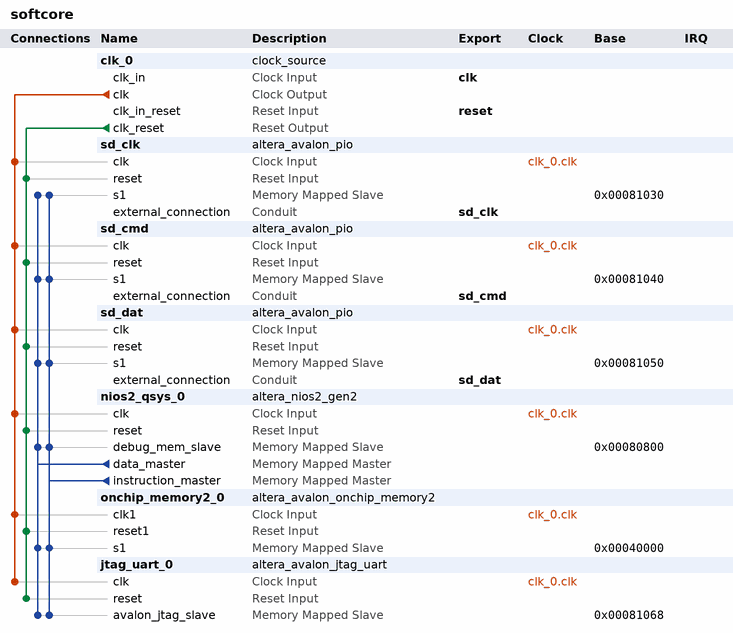
[diagram p0: system contents]
# Platform Designer (Qsys) system softcore, Cyclone V 5CEBA4F23C7
# Parameters at their usual value, and those the tool derives, are not listed.
package require -exact qsys 17.0
create_system softcore
set_project_property DEVICE_FAMILY {Cyclone V}
set_project_property DEVICE 5CEBA4F23C7

add_instance clk_0 clock_source 17.0
set_instance_parameter_value clk_0 clockFrequency 50000000

add_instance sd_clk altera_avalon_pio 17.0
set_instance_parameter_value sd_clk direction Output
set_instance_parameter_value sd_clk width 1

add_instance sd_cmd altera_avalon_pio 17.0
set_instance_parameter_value sd_cmd direction Bidir
set_instance_parameter_value sd_cmd width 1

add_instance sd_dat altera_avalon_pio 17.0
set_instance_parameter_value sd_dat direction Bidir
set_instance_parameter_value sd_dat width 4

add_instance nios2_qsys_0 altera_nios2_gen2 17.0
set_instance_parameter_value nios2_qsys_0 dcache_size 2048
set_instance_parameter_value nios2_qsys_0 exceptionSlave onchip_memory2_0.s1
set_instance_parameter_value nios2_qsys_0 icache_size 4096
set_instance_parameter_value nios2_qsys_0 impl Tiny
set_instance_parameter_value nios2_qsys_0 resetSlave onchip_memory2_0.s1
set_instance_parameter_value nios2_qsys_0 setting_activateTrace true

add_instance onchip_memory2_0 altera_avalon_onchip_memory2 17.0
set_instance_parameter_value onchip_memory2_0 dataWidth 32
set_instance_parameter_value onchip_memory2_0 dualPort false
set_instance_parameter_value onchip_memory2_0 initMemContent true
set_instance_parameter_value onchip_memory2_0 initializationFileName onchip_mem.hex
set_instance_parameter_value onchip_memory2_0 memorySize 262144

add_instance jtag_uart_0 altera_avalon_jtag_uart 17.0
set_instance_parameter_value jtag_uart_0 simInteractiveOptions NO_INTERACTIVE_WINDOWS

# connections
add_connection clk_0.clk jtag_uart_0.clk clock
add_connection clk_0.clk nios2_qsys_0.clk clock
add_connection clk_0.clk onchip_memory2_0.clk1 clock
add_connection clk_0.clk sd_clk.clk clock
add_connection clk_0.clk sd_cmd.clk clock
add_connection clk_0.clk sd_dat.clk clock
add_connection clk_0.clk_reset jtag_uart_0.reset reset
add_connection clk_0.clk_reset nios2_qsys_0.reset reset
add_connection clk_0.clk_reset onchip_memory2_0.reset1 reset
add_connection clk_0.clk_reset sd_clk.reset reset
add_connection clk_0.clk_reset sd_cmd.reset reset
add_connection clk_0.clk_reset sd_dat.reset reset
add_connection nios2_qsys_0.data_master jtag_uart_0.avalon_jtag_slave avalon
set_connection_parameter_value nios2_qsys_0.data_master/jtag_uart_0.avalon_jtag_slave baseAddress 0x00081068
add_connection nios2_qsys_0.data_master nios2_qsys_0.debug_mem_slave avalon
set_connection_parameter_value nios2_qsys_0.data_master/nios2_qsys_0.debug_mem_slave baseAddress 0x00080800
add_connection nios2_qsys_0.data_master onchip_memory2_0.s1 avalon
set_connection_parameter_value nios2_qsys_0.data_master/onchip_memory2_0.s1 baseAddress 0x00040000
add_connection nios2_qsys_0.data_master sd_clk.s1 avalon
set_connection_parameter_value nios2_qsys_0.data_master/sd_clk.s1 baseAddress 0x00081030
add_connection nios2_qsys_0.data_master sd_cmd.s1 avalon
set_connection_parameter_value nios2_qsys_0.data_master/sd_cmd.s1 baseAddress 0x00081040
add_connection nios2_qsys_0.data_master sd_dat.s1 avalon
set_connection_parameter_value nios2_qsys_0.data_master/sd_dat.s1 baseAddress 0x00081050
add_connection nios2_qsys_0.instruction_master jtag_uart_0.avalon_jtag_slave avalon
set_connection_parameter_value nios2_qsys_0.instruction_master/jtag_uart_0.avalon_jtag_slave baseAddress 0x00081068
add_connection nios2_qsys_0.instruction_master nios2_qsys_0.debug_mem_slave avalon
set_connection_parameter_value nios2_qsys_0.instruction_master/nios2_qsys_0.debug_mem_slave baseAddress 0x00080800
add_connection nios2_qsys_0.instruction_master onchip_memory2_0.s1 avalon
set_connection_parameter_value nios2_qsys_0.instruction_master/onchip_memory2_0.s1 baseAddress 0x00040000
add_connection nios2_qsys_0.instruction_master sd_clk.s1 avalon
set_connection_parameter_value nios2_qsys_0.instruction_master/sd_clk.s1 baseAddress 0x00081030
add_connection nios2_qsys_0.instruction_master sd_cmd.s1 avalon
set_connection_parameter_value nios2_qsys_0.instruction_master/sd_cmd.s1 baseAddress 0x00081040
add_connection nios2_qsys_0.instruction_master sd_dat.s1 avalon
set_connection_parameter_value nios2_qsys_0.instruction_master/sd_dat.s1 baseAddress 0x00081050

# exported interfaces
add_interface clk clock sink
set_interface_property clk EXPORT_OF clk_0.clk_in
add_interface reset reset sink
set_interface_property reset EXPORT_OF clk_0.clk_in_reset
add_interface sd_clk conduit end
set_interface_property sd_clk EXPORT_OF sd_clk.external_connection
add_interface sd_cmd conduit end
set_interface_property sd_cmd EXPORT_OF sd_cmd.external_connection
add_interface sd_dat conduit end
set_interface_property sd_dat EXPORT_OF sd_dat.external_connection

set_interconnect_requirement {$system} qsys_mm.clockCrossingAdapter HANDSHAKE
set_interconnect_requirement {$system} qsys_mm.maxAdditionalLatency 1

save_system softcore.qsys
